# Altium schematic sheet PowerSupply.SchDoc
size B; CompanyName: Microchip Technology Inc.; Organization: Microchip Technology; Address1: 2355 West Chandler Blvd.; Address2: Chandler, AZ  85224; Address4: USA; SheetNumber: 2; SheetTotal: 2; SheetTitle: **; Time: Time
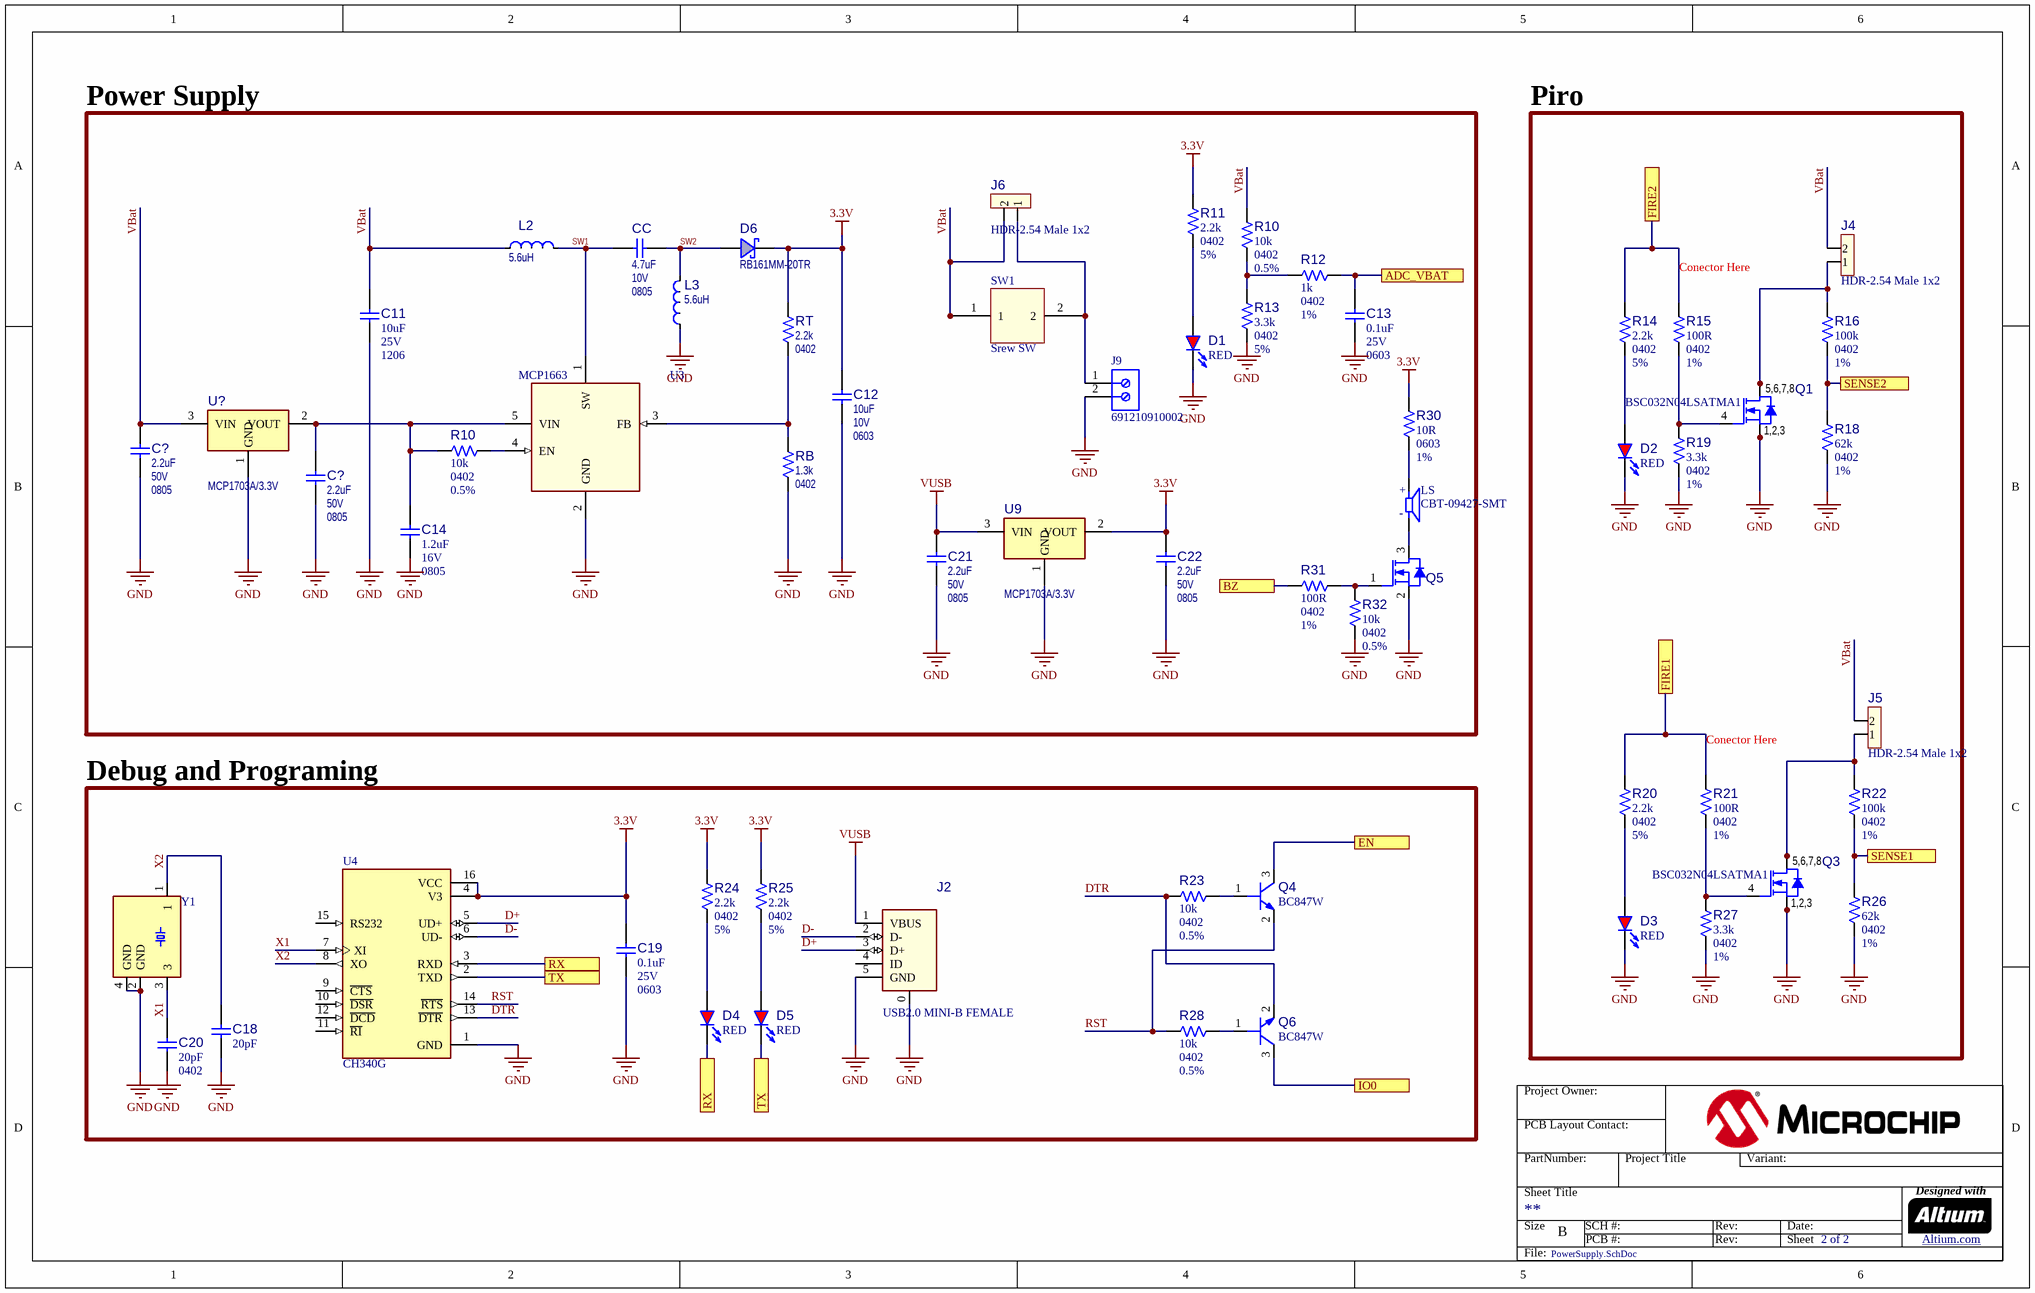
[diagram p0: PowerSupply.SchDoc]

## Parts
(Parts that share a designator on the sheet are numbered #1, #2 ... from top to bottom, then left to right.)
C11  value 10uF  Voltage: 25V  Package: 1206  [CAP_C_1206]  (hidden comment: Capacitor NP)
C12  value 10uF  Voltage: 10V  Package: 0603  [CAP_C_0603]  (hidden comment: Capacitor NP)
C13  value 0.1uF  Voltage: 25V  Package: 0603  [CAP_C_0603]  (hidden comment: Capacitor NP)
C14  value 1.2uF  Voltage: 16V  Package: 0805  [CAP_C_0805]  (hidden comment: Capacitor NP)
C18  value 20pF  [CAP_C_0402]  (hidden comment: Capacitor NP)
C19  value 0.1uF  Voltage: 25V  Package: 0603  [CAP_C_0603]  (hidden comment: Capacitor NP)
C20  value 20pF  Package: 0402  [CAP_C_0402]  (hidden comment: Capacitor NP)
C21  value 2.2uF  Voltage: 50V  Package: 0805  [CAP_C_0805]  (hidden comment: Capacitor NP)
C22  value 2.2uF  Voltage: 50V  Package: 0805  [CAP_C_0805]  (hidden comment: Capacitor NP)
C?#1  value 2.2uF  Voltage: 50V  Package: 0805  [CAP_C_0805]  (hidden comment: Capacitor NP)
C?#2  value 2.2uF  Voltage: 50V  Package: 0805  [CAP_C_0805]  (hidden comment: Capacitor NP)
CC  value 4.7uF  Voltage: 10V  Package: 0805  [CAP_C_0805]  (hidden comment: Capacitor NP)
D1  value RED  [LED_0603_RED]  (hidden comment: LED_red)
D2  value RED  [LED_0603_RED]  (hidden comment: LED_red)
D3  value RED  [LED_0603_RED]  (hidden comment: LED_red)
D4  value RED  [LED_0603_RED]  (hidden comment: LED_red)
D5  value RED  [LED_0603_RED]  (hidden comment: LED_red)
D6  value RB161MM-20TR  [SOD-123FL_L]  (hidden comment: Diode Schottky)
J2  value USB2.0 MINI-B FEMALE  [CON_USB-B_Mini_SMD_RA_HIR_UX60-MB-5ST]  (hidden comment: CON USB2.0 Mini_Micro)
J4  value HDR-2.54 Male 1x2  [HDR_M_2.54_1x2]  (hidden comment: Header 1x2)
J5  value HDR-2.54 Male 1x2  [HDR_M_2.54_1x2]  (hidden comment: Header 1x2)
J6  value HDR-2.54 Male 1x2  [HDR_M_2.54_1x2]  (hidden comment: Header 1x2)
J9  691210910002  [691210910002]
L2  value 5.6uH  [IND_CFT_SRP3020_L3.5W3.2H1.8_L]  (hidden comment: Inductor)
L3  value 5.6uH  [IND_CFT_SRP3020_L3.5W3.2H1.8_L]  (hidden comment: Inductor)
LS  CBT-09427-SMT  [CUI_CBT-09427-SMT]
Q1  value BSC032N04LSATMA1  [PDFN-8_5x6]  (hidden comment: Transistor MOS-N SSSGDDDD)
Q3  value BSC032N04LSATMA1  [PDFN-8_5x6]  (hidden comment: Transistor MOS-N SSSGDDDD)
Q4  value BC847W  [SOT-323-3]  (hidden comment: Transistor NPN BEC)
Q5  Transistor MOS-N GSD  [SOT-23-3]  (value not drawn)
Q6  value BC847W  [SOT-323-3]  (hidden comment: Transistor NPN BEC)
R10#1  value 10k  Package: 0402  Tolerance: 0.5%  [RES_C_0402]  (hidden comment: Resistor)
R10#2  value 10k  Package: 0402  Tolerance: 0.5%  [RES_C_0402]  (hidden comment: Resistor)
R11  value 2.2k  Package: 0402  Tolerance: 5%  [RES_C_0402]  (hidden comment: Resistor)
R12  value 1k  Package: 0402  Tolerance: 1%  [RES_C_0402]  (hidden comment: Resistor)
R13  value 3.3k  Package: 0402  Tolerance: 5%  [RES_C_0402]  (hidden comment: Resistor)
R14  value 2.2k  Package: 0402  Tolerance: 5%  [RES_C_0402]  (hidden comment: Resistor)
R15  value 100R  Package: 0402  Tolerance: 1%  [RES_C_0402]  (hidden comment: Resistor)
R16  value 100k  Package: 0402  Tolerance: 1%  [RES_C_0402]  (hidden comment: Resistor)
R18  value 62k  Package: 0402  Tolerance: 1%  [RES_C_0402]  (hidden comment: Resistor)
R19  value 3.3k  Package: 0402  Tolerance: 1%  [RES_C_0402]  (hidden comment: Resistor)
R20  value 2.2k  Package: 0402  Tolerance: 5%  [RES_C_0402]  (hidden comment: Resistor)
R21  value 100R  Package: 0402  Tolerance: 1%  [RES_C_0402]  (hidden comment: Resistor)
R22  value 100k  Package: 0402  Tolerance: 1%  [RES_C_0402]  (hidden comment: Resistor)
R23  value 10k  Package: 0402  Tolerance: 0.5%  [RES_C_0402]  (hidden comment: Resistor)
R24  value 2.2k  Package: 0402  Tolerance: 5%  [RES_C_0402]  (hidden comment: Resistor)
R25  value 2.2k  Package: 0402  Tolerance: 5%  [RES_C_0402]  (hidden comment: Resistor)
R26  value 62k  Package: 0402  Tolerance: 1%  [RES_C_0402]  (hidden comment: Resistor)
R27  value 3.3k  Package: 0402  Tolerance: 1%  [RES_C_0402]  (hidden comment: Resistor)
R28  value 10k  Package: 0402  Tolerance: 0.5%  [RES_C_0402]  (hidden comment: Resistor)
R30  value 10R  Package: 0603  Tolerance: 1%  [RES_C_0603]  (hidden comment: Resistor)
R31  value 100R  Package: 0402  Tolerance: 1%  [RES_C_0402]  (hidden comment: Resistor)
R32  value 10k  Package: 0402  Tolerance: 0.5%  [RES_C_0402]  (hidden comment: Resistor)
RB  value 1.3k  Package: 0402  [RES_C_0402]  (hidden comment: Resistor)
RT  value 2.2k  Package: 0402  [RES_C_0402]  (hidden comment: Resistor)
SW1  Srew SW  [Screw_SW]
U3  value MCP1663  [SOT-23-5]  (hidden comment: MCP1663 SOT-23-5)
U4  CH340G  [SOIC127P600X180-16N]
U9  value MCP1703A/3.3V  [SOT-23A-3]  (hidden comment: MCP170X SOT-23-3_SOT-23A-3)
U?  value MCP1703A/3.3V  [SOT-23A-3]  (hidden comment: MCP170X SOT-23-3_SOT-23A-3)
Y1  ABM8-12.000MHZ-B2-T3  [OSCSC320X250X100N]  (value not drawn)

## Blocks framed on the sheet
Power Supply: C11-C14 C21 C22 C?#1 C?#2 CC D1 D6 J6 J9 L2 L3 LS Q5 R10#1 R10#2 R11-R13 R30-R32 RB RT SW1 U3 U9 U?
Piro: D2 D3 J4 J5 Q1 Q3 R14-R16 R18-R22 R26 R27
Debug and Programing: C18-C20 D4 D5 J2 Q4 Q6 R23-R25 R28 U4 Y1

## Ports
ADC_VBAT, BZ, EN, FIRE1, FIRE2, IO0, RX, SENSE1, SENSE2, TX

## Nets
3.3V: C12.2 C19.2 C22.2 D6.2(K) R11.2 R24.2 R25.2 R30.2 RT.2 U4.4(V3) U4.16(VCC) U9.2(VOUT)
GND: C11.1 C12.1 C13.1 C14.1 C18.1 C19.1 C20.1 C21.1 C22.1 C?#1.1 C?#2.1 D1.2(K) D2.2(K) D3.2(K) J2.0(SHLD) J2.5(GND) J9.2 L3.1(S) Q1.1(S) Q1.2(S) Q1.3(S) Q3.1(S) Q3.2(S) Q3.3(S) Q5.2(S) R13.1 R18.1 R19.1 R26.1 R27.1 R32.1 RB.1 U3.2(GND) U4.1(GND) U9.1(GND) U?.1(GND) Y1.2(GND) Y1.4(GND)
VUSB: C21.2 J2.1(VBUS) U9.3(VIN)
ADC_VBAT: C13.2 R12.2 ; port ADC_VBAT
BZ: R31.2 ; port BZ
D+: J2.3(D+) U4.5(UD+)
D-: J2.2(D-) U4.6(UD-)
DTR: Q6.2(E) R23.1 U4.13(~{DTR})
EN: Q4.3(C) ; port EN
FIRE1: R20.2 R21.2 ; port FIRE1
FIRE2: R14.2 R15.2 ; port FIRE2
IO0: Q6.3(C) ; port IO0
RST: Q4.2(E) R28.1 U4.14(~{RTS})
RX: D4.2(K) U4.3(RXD) ; port RX
SENSE1: R22.1 R26.2 ; port SENSE1
SENSE2: R16.1 R18.2 ; port SENSE2
SW1: CC.1 L2.2(F) U3.1(SW)
SW2: CC.2 D6.1(A) L3.2(F)
TX: D5.2(K) U4.2(TXD) ; port TX
VBat: C11.2 C?#1.2 J4.2 J5.2 J6.2 L2.1(S) R10#1.2 SW1.1 U?.3(VIN)
X1: C20.2 U4.7(XI) Y1.3
X2: C18.2 U4.8(XO) Y1.1
NetC14_2: C14.2 C?#2.2 R10#2.2 U3.5(VIN) U?.2(VOUT)
NetD1_1: D1.1(A) R11.1
NetD2_1: D2.1(A) R14.1
NetD3_1: D3.1(A) R20.1
NetD4_1: D4.1(A) R24.1
NetD5_1: D5.1(A) R25.1
NetJ4_1: J4.1 Q1.5(D) Q1.6(D) Q1.7(D) Q1.8(D) R16.2
NetJ5_1: J5.1 Q3.5(D) Q3.6(D) Q3.7(D) Q3.8(D) R22.2
NetJ6_1: J6.1 J9.1 SW1.2
NetLS_M: LS.M Q5.3(D)
NetLS_P: LS.P R30.1
NetQ1_4: Q1.4(G) R15.1 R19.2
NetQ3_4: Q3.4(G) R21.1 R27.2
NetQ4_1: Q4.1(B) R23.2
NetQ5_1: Q5.1(G) R31.1 R32.2
NetQ6_1: Q6.1(B) R28.2
NetR10#1_1: R10#1.1 R12.1 R13.2
NetR10#2_1: R10#2.1 U3.4(EN)
NetRB_2: RB.2 RT.1 U3.3(FB)

Not connected (* = marked no-connect by the designer): J2 4(ID); U4 9(~{CTS}) 10(~{DSR}) 11(~{RI}) 12(~{DCD}) 15(RS232)

## Notes on the sheet
- (near R15) Conector Here
- (near R21) Conector Here
- Project Owner:
- PCB Layout Contact:
- PartNumber:
- Project Title
- Variant:
- Sheet Title
- Size
- B
- SCH #:
- PCB #:
- Rev:
- Date:
- Sheet
- Designed with
- Altium.com <http://go.altium.com/MicrochipLandingPage_Evaluation.html>
- File:
- (in symbol CBT-09427-SMT) +; -
- (in symbol TRA1320) 5,6,7,8; 1,2,3

## Library data of the parts
C11 = CAP1159: Manufacturer 1: Murata Electronics North America; Manufacturer Part Number 1: GRM31CR71E106KA12L; Description_: CAP CER 10uF 25V 10% X7R SMD 1206; Dev Tools Status: Production; Tolerance: 10%; Temperature Coefficient: X7R; Type: Ceramic; Owner: Adrian T (M91397); Populated: Yes; MCHP-ID: CAP1159; Revision: 0; Symbol: Capacitor NP; Status: MCL Design; ComponentLink1URL: https://chn-vm-apps.microchip.com/mchprepo/parts/Datasheets/mlcc01_e.pdf; ComponentLink1Description: SVN Datasheet; ComponentLink2URL: C:\ALTIUM_WORK\00001_MCHP-CDB\Datasheets\mlcc01_e.pdf; ComponentLink2Description: Local Datasheet; ComponentLink3URL: C:\ALTIUM_WORK\00001_MCHP-CDB\Library\LibraryRefs\Capacitor NP.SchLib; ComponentLink3Description: Open Symbol; ComponentLink4URL: C:\ALTIUM_WORK\00001_MCHP-CDB\Library\Footprints\CAP_C_1206.PcbLib; ComponentLink4Description: Open Footprint; ComponentLink5Description: Open Footprint 2; ComponentLink6Description: Open Footprint 3; ComponentLink7Description: Open Footprint 4; Operating Temperature: -55C to +125C; Category: Capacitor; Manufacturer 2: Taiyo Yuden; Manufacturer Part Number 2: TMK316B7106KL-TD; Supplier 1: Digi-Key; Supplier Part Number 1: 490-6518-1-ND; Supplier 2: Digi-Key; Supplier Part Number 2: 587-2399-1-ND; Quantity Override: 1
C12 = CAP0542: Capacitor; Manufacturer 1: Samsung; Manufacturer Part Number 1: CL10A106MP8NNNC; Description_: CAP CER 10uF 10V 20% X5R SMD 0603; Dev Tools Status: Production; Tolerance: 20%; Temperature Coeffcient: X5R; Type: Ceramic; Populated: Yes; MCHP-ID: CAP0542; Revision: 2; Symbol: Capacitor NP; Status: MCL Design; ComponentLink1URL: https://chn-vm-apps.microchip.com/mchprepo/parts/Datasheets/ECJ__General_.pdf; ComponentLink1Description: SVN Datasheet; ComponentLink2URL: C:\ALTIUM_WORK\00001_MCHP-CDB\Datasheets\ECJ__General_.pdf; ComponentLink2Description: Local Datasheet; ComponentLink3URL: C:\ALTIUM_WORK\00001_MCHP-CDB\Library\LibraryRefs\Capacitor NP.SchLib; ComponentLink3Description: Open Symbol; ComponentLink4URL: C:\ALTIUM_WORK\00001_MCHP-CDB\Library\Footprints\CAP_C_0603.PcbLib; ComponentLink4Description: Open Footprint; ComponentLink5Description: Open Footprint 2; ComponentLink6Description: Open Footprint 3; ComponentLink7Description: Open Footprint 4; Operating Temperature: -55C to +85C; Category: Capacitor; Manufacturer 2: TDK Corporation; Manufacturer Part Number 2: C1608X5R1A106M; Manufacturer 3: Panasonic; Manufacturer Part Number 3: ECJ-1VB1A106M; Supplier 1: Digi-Key; Supplier Part Number 1: 1276-1871-1-ND; Supplier 2: Digi-Key; Supplier Part Number 2: 445-6853-1-ND; Supplier 3: Digi-Key; Supplier Part Number 3: PCC2479CT-ND; Quantity Override: 1
C13 C19 = CAP0380: Manufacturer 1: AVX; Manufacturer Part Number 1: 06033D104KAT2A; Description_: CAP CER 0.1uF 25V 10% X5R SMD 0603; Dev Tools Status: Production; Tolerance: 10%; Temperature Coefficient: X5R; Type: Ceramic; Populated: Yes; MCHP-ID: CAP0380; Revision: 1; Symbol: Capacitor NP; Status: MCL Design; ComponentLink1URL: https://chn-vm-apps.microchip.com/mchprepo/parts/Datasheets/smccp.pdf; ComponentLink1Description: SVN Datasheet; ComponentLink2URL: C:\ALTIUM_WORK\00001_MCHP-CDB\Datasheets\smccp.pdf; ComponentLink2Description: Local Datasheet; ComponentLink3URL: C:\ALTIUM_WORK\00001_MCHP-CDB\Library\LibraryRefs\Capacitor NP.SchLib; ComponentLink3Description: Open Symbol; ComponentLink4URL: C:\ALTIUM_WORK\00001_MCHP-CDB\Library\Footprints\CAP_C_0603.PcbLib; ComponentLink4Description: Open Footprint; ComponentLink5Description: Open Footprint 2; ComponentLink6Description: Open Footprint 3; ComponentLink7Description: Open Footprint 4; Operating Temperature: -55C to +85C; Category: Capacitor; Supplier 1: Digi-Key; Supplier Part Number 1: 478-1244-1-ND; Quantity Override: 1
C14 = CAP1752: Manufacturer 1: KEMET; Manufacturer Part Number 1: C0805C125K4RACTU; Description_: CAP CER 1.2uF 16V 10% X7R SMD 0805; Dev Tools Status: Design; Tolerance: 10%; Temperature Coefficient: X7R; Type: Ceramic; Owner: Alexandru Chiser - M19201; Populated: YES; MCHP-ID: CAP1752; Revision: A; Symbol: Capacitor NP; Status: MCL Design; ComponentLink1URL: https://chn-vm-apps.microchip.com/mchprepo/parts/Datasheets/KEM_C1002_X7R_SMD.pdf; ComponentLink1Description: SVN Datasheet; ComponentLink2URL: C:\ALTIUM_WORK\00001_MCHP-CDB\Datasheets\KEM_C1002_X7R_SMD.pdf; ComponentLink2Description: Local Datasheet; ComponentLink3URL: C:\ALTIUM_WORK\00001_MCHP-CDB\Library\LibraryRefs\Capacitor NP.SchLib; ComponentLink3Description: Open Symbol; ComponentLink4URL: C:\ALTIUM_WORK\00001_MCHP-CDB\Library\Footprints\CAP_C_0805.PcbLib; ComponentLink4Description: Open Footprint; ComponentLink5Description: Open Footprint 2; ComponentLink6Description: Open Footprint 3; ComponentLink7Description: Open Footprint 4; Operating Temperature: -55C to +125C; Category: Capacitor; Supplier 1: Digi-Key; Supplier Part Number 1: 399-4927-1-ND; Quantity Override: 1
C18 C20 = CAP2438: Manufacturer 1: Samsung Electro-Mechanics; Manufacturer Part Number 1: CL05C200GB51PNC; Voltage: 50V; Description_: Ceramic capacitor, SMD 0402, 20pF, C0G, 50V, +/-2%; Dev Tools Status: Production; Tolerance: 2%; Temperature Coefficient: C0G; Type: Ceramic; Owner: Dragos Danaila; Populated: YES; MCHP-ID: CAP2438; Revision: 1; Symbol: Capacitor NP; Status: MCL Design; ComponentLink1Description: SVN Datasheet; ComponentLink2Description: Local Datasheet; ComponentLink3URL: C:\ALTIUM_WORK\00001_MCHP-CDB\Library\LibraryRefs\Capacitor NP.SchLib; ComponentLink3Description: Open Symbol; ComponentLink4URL: C:\ALTIUM_WORK\00001_MCHP-CDB\Library\Footprints\CAP_C_0402.PcbLib; ComponentLink4Description: Open Footprint; ComponentLink5Description: Open Footprint 2; ComponentLink6Description: Open Footprint 3; ComponentLink7Description: Open Footprint 4; Operating Temperature: -55C to +125C; Category: Capacitor; Supplier 1: Digikey; Supplier Part Number 1: 1276-CL05C200GB51PNCTR-ND; Quantity Override: 1
  C18: Package: 0402
C21 C22 C?#1 C?#2 = CAP1017: Capacitor; Manufacturer 1: TDK; Manufacturer Part Number 1: C2012X5R1H225K; Description_: CAP CER 2.2uF 50V 10% X5R SMD 0805; Dev Tools Status: Production; Tolerance: 10%; Temperature Coeffcient: X5R; Type: Ceramic; Owner: Brent Lanphear; Populated: Yes; MCHP-ID: CAP1017; Revision: 2; Symbol: Capacitor NP; Status: MCL Design; ComponentLink1URL: https://chn-vm-apps.microchip.com/mchprepo/parts/Datasheets/general_B11.pdf; ComponentLink1Description: SVN Datasheet; ComponentLink2URL: C:\ALTIUM_WORK\00001_MCHP-CDB\Datasheets\general_B11.pdf; ComponentLink2Description: Local Datasheet; ComponentLink3URL: C:\ALTIUM_WORK\00001_MCHP-CDB\Library\LibraryRefs\Capacitor NP.SchLib; ComponentLink3Description: Open Symbol; ComponentLink4URL: C:\ALTIUM_WORK\00001_MCHP-CDB\Library\Footprints\CAP_C_0805.PcbLib; ComponentLink4Description: Open Footprint; ComponentLink5Description: Open Footprint 2; ComponentLink6Description: Open Footprint 3; ComponentLink7Description: Open Footprint 4; Operating Temperature: -55C to +85C; Category: Capacitor; Supplier 1: Digi-Key; Supplier Part Number 1: 445-5976-1-ND; Quantity Override: 1
CC = CAP0092: Capacitor; Manufacturer 1: Panasonic; Manufacturer Part Number 1: ECJ-2YF1A475Z; Description_: CAP CER 4.7uF 10V 20% Y5V SMD 0805; Dev Tools Status: Production; Tolerance: 20%; Temperature Coeffcient: Y5V; Populated: Yes; MCHP-ID: CAP0092; Revision: 1; Symbol: Capacitor NP; Status: MCL Design; ComponentLink1URL: https://chn-vm-apps.microchip.com/mchprepo/parts/Datasheets/ECJ__General_.pdf; ComponentLink1Description: SVN Datasheet; ComponentLink2URL: C:\ALTIUM_WORK\00001_MCHP-CDB\Datasheets\ECJ__General_.pdf; ComponentLink2Description: Local Datasheet; ComponentLink3URL: C:\ALTIUM_WORK\00001_MCHP-CDB\Library\LibraryRefs\Capacitor NP.SchLib; ComponentLink3Description: Open Symbol; ComponentLink4URL: C:\ALTIUM_WORK\00001_MCHP-CDB\Library\Footprints\CAP_C_0805.PcbLib; ComponentLink4Description: Open Footprint; ComponentLink5Description: Open Footprint 2; ComponentLink6Description: Open Footprint 3; ComponentLink7Description: Open Footprint 4; Operating Temperature: -30C to +85C; Type: Ceramic; Category: Capacitor; Supplier 1: Digi-Key; Supplier Part Number 1: PCC1842TR-ND; Quantity Override: 1
D1-D5 = DIODE1066: LED; Manufacturer 1: Lumex; Manufacturer Part Number 1: SML-LX0603SRW-TR; Description_: DIO LED RED 1.7V 20mA 15mcd Diffuse SMD 0603; Dev Tools Status: Production; Type: LED Single; Forward Current: 20mA; Reverse Current: 100uA; Reverse Voltage: 5V; Owner: Tad Ahlvers; Populated: YES; MCHP-ID: DIODE1066; Revision: 1; Symbol: LED_red; Status: MCL Design; Package: 0603; ComponentLink1URL: https://chn-vm-apps.microchip.com/mchprepo/parts/Datasheets/SML-LX0603SRW-TR.pdf; ComponentLink1Description: SVN Datasheet; ComponentLink2URL: C:\ALTIUM_WORK\00001_MCHP-CDB\Datasheets\SML-LX0603SRW-TR.pdf; ComponentLink2Description: Local Datasheet; ComponentLink3URL: C:\ALTIUM_WORK\00001_MCHP-CDB\Library\LibraryRefs\LED_red.SchLib; ComponentLink3Description: Open Symbol; ComponentLink4URL: C:\ALTIUM_WORK\00001_MCHP-CDB\Library\Footprints\LED_0603_RED.PcbLib; ComponentLink4Description: Open Footprint; ComponentLink5Description: Open Footprint 2; ComponentLink6Description: Open Footprint 3; ComponentLink7Description: Open Footprint 4; Operating Temperature: -40C to +85C; Category: Diode; Supplier 1: Digi-Key; Supplier Part Number 1: 67-1551-1-ND; Quantity Override: 1
D6 = DIODE1297: DIO SCTKY RB160M-60TR 550mV 1A 60V SMD SOD-123F; Manufacturer 1: Rohm Semiconductor; Description_: DIO SCTKY RB161MM-20TR 350mV 1A 20V SMD SOD-123F; Dev Tools Status: Production; Type: Schottky Single; Reverse Current: 700uA; Reverse Recovery Time: 500ns; Reverse Voltage: 20V; Owner: Tim Moffat; Populated: YES; MCHP-ID: DIODE1297; Revision: 1; Symbol: Diode Schottky; Status: MCL Design; Package: SOD-123F; ComponentLink1URL: https://chn-vm-apps.microchip.com/mchprepo/parts/Datasheets/rb161mm-20.pdf; ComponentLink1Description: SVN Datasheet; ComponentLink2URL: C:\ALTIUM_WORK\00001_MCHP-CDB\Datasheets\rb161mm-20.pdf; ComponentLink2Description: Local Datasheet; ComponentLink3URL: C:\ALTIUM_WORK\00001_MCHP-CDB\Library\LibraryRefs\Diode Schottky.SchLib; ComponentLink3Description: Open Symbol; ComponentLink4URL: C:\ALTIUM_WORK\00001_MCHP-CDB\Library\Footprints\SOD-123FL.PcbLib; ComponentLink4Description: Open Footprint; ComponentLink5URL: C:\ALTIUM_WORK\00001_MCHP-CDB\Library\Footprints\SOD-123FL_L.PcbLib; ComponentLink5Description: Open Footprint 2; ComponentLink6Description: Open Footprint 3; ComponentLink7Description: Open Footprint 4; Operating Temperature: -40C to +125C; Category: Diode; Forward Current: 1A; Manufacturer Part Number 1: RB161MM-20TR; Supplier 1: Digi-Key; Supplier Part Number 1: RB161MM-20CT-ND; Quantity Override: 1
J2 = CON0276: Manufacturer 1: Wurth Electronics Inc; Manufacturer Part Number 1: 651305142821; Description_: CON USB2.0 MINI-B FEMALE SMD R/A; Dev Tools Status: Production; Populated: YES; MCHP-ID: CON0276; Revision: 2; Symbol: CON USB2.0 Mini_Micro; Status: MCL Design; ComponentLink1URL: https://chn-vm-apps.microchip.com/mchprepo/parts/Datasheets/e24000019.pdf; ComponentLink1Description: SVN Datasheet; ComponentLink2URL: C:\ALTIUM_WORK\00001_MCHP-CDB\Datasheets\e24000019.pdf; ComponentLink2Description: Local Datasheet; ComponentLink3URL: C:\ALTIUM_WORK\00001_MCHP-CDB\Library\LibraryRefs\CON USB2.0 Mini_Micro.SchLib; ComponentLink3Description: Open Symbol; ComponentLink4URL: C:\ALTIUM_WORK\00001_MCHP-CDB\Library\Footprints\CON_USB-B_Mini_SMD_RA_HIR_UX60-MB-5ST.PcbLib; ComponentLink4Description: Open Footprint; ComponentLink5Description: Open Footprint 2; ComponentLink6Description: Open Footprint 3; ComponentLink7Description: Open Footprint 4; Type: USB; Category: Connector; Manufacturer 2: Hirose; Manufacturer Part Number 2: UX60-MB-5ST; Manufacturer 3: Oupiin; Manufacturer Part Number 3: 8969-B05C00DBU; Manufacturer 4: Dongguan Yang Ming Precision Plastic Hardware Electronics Co., Ltd. (ShenZhen YangMing); Manufacturer Part Number 4: YM-02-04-A-36; Supplier 1: Digi-Key; Supplier Part Number 1: 732-3154-1-ND; Supplier 2: Digi-Key; Supplier Part Number 2: H2959CT-ND; Supplier 3: Digi-Key; Supplier Part Number 3: H2959TR-ND; Supplier 4: Oupiin; Supplier Part Number 4: 8969-B05C00DBU; Supplier 5: Raynen; Supplier Part Number 5: PLUG00033B01M; Quantity Override: 1
J4-J6 = CON1108: Manufacturer 1: FCI; Manufacturer Part Number 1: 68001-202HLF; Manufacturer 10: WURTH ELEKTRONIK; Manufacturer Part Number 10: 61300211121; Description_: CON HDR-2.54 Male 1x2 Gold 5.84MH TH VERT; Dev Tools Status: Production; Owner: Bogdan P (M91398); Populated: Yes; MCHP-ID: CON1108; Revision: 1; Symbol: Header 1x2; Status: MCL Design; ComponentLink1URL: https://chn-vm-apps.microchip.com/mchprepo/parts/Datasheets/77311.pdf; ComponentLink1Description: SVN Datasheet; ComponentLink2URL: C:\ALTIUM_WORK\00001_MCHP-CDB\Datasheets\77311.pdf; ComponentLink2Description: Local Datasheet; ComponentLink3URL: C:\ALTIUM_WORK\00001_MCHP-CDB\Library\LibraryRefs\Header 1x2.SchLib; ComponentLink3Description: Open Symbol; ComponentLink4URL: C:\ALTIUM_WORK\00001_MCHP-CDB\Library\Footprints\HDR_M_2.54_1x2.PcbLib; ComponentLink4Description: Open Footprint; ComponentLink5Description: Open Footprint 2; ComponentLink6Description: Open Footprint 3; ComponentLink7Description: Open Footprint 4; Type: Header 2.54mm; Category: Connector; Manufacturer 2: FCI; Manufacturer Part Number 2: 77311-118-02LF; Manufacturer 3: FCI; Manufacturer Part Number 3: 68000-202HLF; Manufacturer 4: Samtec; Manufacturer Part Number 4: TSW-102-07-G-S; Manufacturer 5: Sullins; Manufacturer Part Number 5: PBC02SAAN; Manufacturer 6: SPC Technology; Manufacturer Part Number 6: SPC20481; Manufacturer 7: Samtec; Manufacturer Part Number 7: TSW-102-07-F-S; Manufacturer 8: Nextron; Manufacturer Part Number 8: R-211-0211-0021-000; Manufacturer 9: Samtec; Manufacturer Part Number 9: TSW-102-07-S-S; Supplier 1: Digi-Key; Supplier Part Number 1: 609-3469-ND; Supplier 2: Digi-Key; Supplier Part Number 2: 609-4434-ND; Supplier 3: Digi-Key; Supplier Part Number 3: 609-3502-ND; Supplier 4: Digi-Key; Supplier Part Number 4: SAM1029-02-ND; Supplier 5: Digi-Key; Supplier Part Number 5: S1011E-02-ND; Supplier 6: Newark; Supplier Part Number 6: 93K5734; Supplier 7: Newark; Supplier Part Number 7: 79P3146; Supplier 8: Nextron; Supplier Part Number 8: Nextron R-211-0211-0021-000; Supplier 9: Samtec; Supplier Part Number 9: TSW-102-07-S-S; Supplier 10: Digi-Key; Supplier Part Number 10: 732-5315-ND; Quantity Override: 1
J9 = 691210910002: WR-TBL Serie 2109 Horizontal Entry, Rising Cage Clamp, THT, pitch 2.54mm, 2p; Manufacturer: Wurth Elektronik; Modularity: No; PCB/Cable/Panel: PCB; Pin Number: 2; Rated Current [UL]: 6A; Working Voltage [UL]: 150VAC; ComponentLink1Description: Manufacturer; ComponentLink1URL: http://www.we-online.de; ComponentLink2URL: https://katalog.we-online.de/em/datasheet/691210910002.pdf; ComponentLink2Description: Datasheet; Mounting Technology: THT; Manufacturer Part Number: 691210910002; Packaging: Box; Operating Temperature: -40 to +105degC; Pitch: 2.54mm; Published Date: Feburary 2021; Type: Horizontal; Application: Rising Cage Clamp
L2 L3 = IND1638: Manufacturer 1: Bourns Inc.; Manufacturer Part Number 1: SRP3020TA-5R6M; Description_: FIXED IND 5.6uH 2.2A 238mOHM SMD AEC-Q200; Dev Tools Status: Design; Owner: Cristian Papuc; DCR: 0.238R; Saturation Current: 2.6A; RMS Current: 2.2A; Test Frequency: 100kHz; Populated: YES; MCHP-ID: IND1638; Revision: A; Symbol: Inductor; Status: MCL Design; ComponentLink1URL: https://chn-vm-apps.microchip.com/mchprepo/parts/Datasheets/srp3020ta.pdf; ComponentLink1Description: SVN Datasheet; ComponentLink2URL: C:\ALTIUM_WORK\00001_MCHP-CDB\Datasheets\srp3020ta.pdf; ComponentLink2Description: Local Datasheet; ComponentLink3URL: C:\ALTIUM_WORK\00001_MCHP-CDB\Library\LibraryRefs\Inductor.SchLib; ComponentLink3Description: Open Symbol; ComponentLink4URL: C:\ALTIUM_WORK\00001_MCHP-CDB\Library\Footprints\IND_CFT_SRP3020_L3.5W3.2H1.8.PcbLib; ComponentLink4Description: Open Footprint; ComponentLink5URL: C:\ALTIUM_WORK\00001_MCHP-CDB\Library\Footprints\IND_CFT_SRP3020_L3.5W3.2H1.8_L.PcbLib; ComponentLink5Description: Open Footprint 2; ComponentLink6Description: Open Footprint 3; ComponentLink7Description: Open Footprint 4; Operating Temperature: -40C ~ 150C; Package: L3.5xW3.2xH1.8; Type: Inductor; Category: Inductor; Supplier 1: Digi-Key; Supplier Part Number 1: SRP3020TA-5R6MCT-ND; Quantity Override: 1
LS = CBT-09427-SMT: 9 mm, 3.6 V, 87 dB, Surface Mount _SMT_, Magnetic Audio Transducer Buzzer; MF: CUI Devices; MP: CBT-09427-SMT-TR; SnapEDA_Link: https://www.snapeda.com/parts/CBT-09427-SMT-TR/CUI%20Devices/view-part/547873/?ref=snap; Availability: Unavailable; Value: *; Price: None; Package: CUI Inc.; CUI_purchase_URL: https://www.cuidevices.com/product/audio/buzzers/audio-transducers/cbt-09427-smt-tr?utm_source=snapeda.com&utm_medium=referral&utm_campaign=snapedaBOM
Q1 Q3 = TRA1320: Manufacturer 1: Infineon Technologies; Description_: TRANS FET N-CH  BSC032N04LSATMA1 40V 98A 52W TDSON-8; Dev Tools Status: Design; Type: FET; Current: 98A; Drain to Source Voltage: 40V; Gate to Source Voltage: 2V; Power: 52W; Owner: Cristian Papuc; Populated: YES; MCHP-ID: TRA1320; Revision: 1; Symbol: Transistor MOS-N SSSGDDDD; Status: MCL Design; Package: TDSON-8; ComponentLink1URL: https://chn-vm-apps.microchip.com/mchprepo/parts/Datasheets/Infineon-BSC032N04LS-DS-v02_01-EN.pdf; ComponentLink1Description: SVN Datasheet; ComponentLink2URL: C:\ALTIUM_WORK\00001_MCHP-CDB\Datasheets\Infineon-BSC032N04LS-DS-v02_01-EN.pdf; ComponentLink2Description: Local Datasheet; ComponentLink3URL: C:\ALTIUM_WORK\00001_MCHP-CDB\Library\LibraryRefs\Transistor MOS-N SSSGDDDD.SchLib; ComponentLink3Description: Open Symbol; ComponentLink4URL: C:\ALTIUM_WORK\00001_MCHP-CDB\Library\Footprints\PDFN-8_5x6.PcbLib; ComponentLink4Description: Open Footprint; ComponentLink5Description: Open Footprint 2; ComponentLink6Description: Open Footprint 3; ComponentLink7Description: Open Footprint 4; Operating Temperature: -55C to +150C; Category: Transistor; Voltage: 40V; Manufacturer Part Number 1: BSC032N04LSATMA1; Supplier 1: Digikey; Supplier Part Number 1: BSC032N04LSATMA1CT-ND; Quantity Override: 1
Q4 Q6 = TRA0094: Transistor Bipolar; Manufacturer 1: NXP Semiconductors; Manufacturer Part Number 1: BC847BW,135; Description_: TRANS BJT NPN BC847W 45V 100mA 200mW SOT-323-3; Dev Tools Status: Production; Type: BJT; Current: 100mA; Power: 200mW; Voltage: 45V; Populated: YES; MCHP-ID: TRA0094; Revision: 2; Symbol: Transistor NPN BEC; Status: MCL Design; Package: SOT-323-3; ComponentLink1URL: https://chn-vm-apps.microchip.com/mchprepo/parts/Datasheets/BC847_BC547_SER.pdf; ComponentLink1Description: SVN Datasheet; ComponentLink2URL: C:\ALTIUM_WORK\00001_MCHP-CDB\Datasheets\BC847_BC547_SER.pdf; ComponentLink2Description: Local Datasheet; ComponentLink3URL: C:\ALTIUM_WORK\00001_MCHP-CDB\Library\LibraryRefs\Transistor NPN BEC.SchLib; ComponentLink3Description: Open Symbol; ComponentLink4URL: C:\ALTIUM_WORK\00001_MCHP-CDB\Library\Footprints\SOT-323-3.PcbLib; ComponentLink4Description: Open Footprint; ComponentLink5Description: Open Footprint 2; ComponentLink6Description: Open Footprint 3; ComponentLink7Description: Open Footprint 4; Operating Temperature: -65C to +150C; Category: Transistor; Supplier 1: Digi-Key; Supplier Part Number 1: BC847BW,135-ND; Quantity Override: 1
Q5 = MIC7247: Transistor MOS; Manufacturer 1: Microchip Technology; Value: 2N7002-G; Description_: MCHP ANALOG MOSFET N-CH 2N7002-G 60V 115mA SOT-23-3; Dev Tools Status: Production; Type: MOSFET; Owner: Mark Loper; Populated: YES; MCHP-ID: MIC7247; Revision: 1; Symbol: Transistor MOS-N GSD; Status: MCL Design; ComponentLink1Description: SVN Datasheet; ComponentLink2URL: C:\ALTIUM_WORK\00001_MCHP-CDB\Datasheets\2N7002.pdf; ComponentLink2Description: Local Datasheet; ComponentLink3URL: C:\ALTIUM_WORK\00001_MCHP-CDB\Library\LibraryRefs\Transistor MOS-N GSD.SchLib; ComponentLink3Description: Open Symbol; ComponentLink4URL: C:\ALTIUM_WORK\00001_MCHP-CDB\Library\Footprints\SOT-23-3.PcbLib; ComponentLink4Description: Open Footprint; ComponentLink5Description: Open Footprint 2; ComponentLink6Description: Open Footprint 3; ComponentLink7Description: Open Footprint 4; Category: MCHP-Analog; Manufacturer Part Number 1: 2N7002-G; Supplier 1: Digi-Key; Supplier Part Number 1: 2N7002-GMCCT-ND; Quantity Override: 1
R10#1 R10#2 R23 R28 R32 = RES1012: Manufacturer 1: SUSUMU; Manufacturer Part Number 1: RR0510P-103-D; Description_: RES TF 10k 0.5% 1/16W SMD 0402; Dev Tools Status: Production; Voltage: 25V; Temperature Coefficient: 25ppm/C; Power: 1/16W; Owner: Tad Ahlvers; Populated: YES; MCHP-ID: RES1012; Revision: 1; Symbol: Resistor; Status: MCL Design; ComponentLink1URL: https://chn-vm-apps.microchip.com/mchprepo/parts/Datasheets/products_12.pdf; ComponentLink1Description: SVN Datasheet; ComponentLink2URL: C:\ALTIUM_WORK\00001_MCHP-CDB\Datasheets\products_12.pdf; ComponentLink2Description: Local Datasheet; ComponentLink3URL: C:\ALTIUM_WORK\00001_MCHP-CDB\Library\LibraryRefs\Resistor.SchLib; ComponentLink3Description: Open Symbol; ComponentLink4URL: C:\ALTIUM_WORK\00001_MCHP-CDB\Library\Footprints\RES_C_0402.PcbLib; ComponentLink4Description: Open Footprint; ComponentLink5Description: Open Footprint 2; ComponentLink6Description: Open Footprint 3; ComponentLink7Description: Open Footprint 4; Operating Temperature: -55C to +125C; Category: Resistor; Type: RES SMD; Composition: TF; Supplier 1: Digi-Key; Supplier Part Number 1: RR05P10.0KDCT-ND; Quantity Override: 1
R11 R14 R20 R24 R25 = RES1020: Manufacturer 1: Vishay Dale; Manufacturer Part Number 1: CRCW04022K20JNED; Description_: RES TKF 2.2k 5% 1/16W SMD 0402; Dev Tools Status: Production; Voltage: 50V; Temperature Coefficient: 200ppm/C; Power: 1/16W; Owner: Tad Ahlvers; Populated: YES; MCHP-ID: RES1020; Revision: 1; Symbol: Resistor; Status: MCL Design; ComponentLink1URL: https://chn-vm-apps.microchip.com/mchprepo/parts/Datasheets/dcrcwe3.pdf; ComponentLink1Description: SVN Datasheet; ComponentLink2URL: C:\ALTIUM_WORK\00001_MCHP-CDB\Datasheets\dcrcwe3.pdf; ComponentLink2Description: Local Datasheet; ComponentLink3URL: C:\ALTIUM_WORK\00001_MCHP-CDB\Library\LibraryRefs\Resistor.SchLib; ComponentLink3Description: Open Symbol; ComponentLink4URL: C:\ALTIUM_WORK\00001_MCHP-CDB\Library\Footprints\RES_C_0402.PcbLib; ComponentLink4Description: Open Footprint; ComponentLink5Description: Open Footprint 2; ComponentLink6Description: Open Footprint 3; ComponentLink7Description: Open Footprint 4; Operating Temperature: -55C to +155C; Category: Resistor; Type: RES SMD; Composition: TKF; Supplier 1: Digi-Key; Supplier Part Number 1: 541-2.2KJCT-ND; Quantity Override: 1
R12 = RES1022: Manufacturer 1: Panasonic; Manufacturer Part Number 1: ERJ-2RKF1001X; Description_: RES TKF 1k 1% 1/10W SMD 0402; Dev Tools Status: Production; Voltage: 50V; Temperature Coefficient: 100ppm/C; Power: 1/10W; Owner: Tad Ahlvers; Populated: YES; MCHP-ID: RES1022; Revision: 2; Symbol: Resistor; Status: MCL Design; ComponentLink1URL: https://chn-vm-apps.microchip.com/mchprepo/parts/Datasheets/AOA0000CE2.pdf; ComponentLink1Description: SVN Datasheet; ComponentLink2URL: C:\ALTIUM_WORK\00001_MCHP-CDB\Datasheets\AOA0000CE2.pdf; ComponentLink2Description: Local Datasheet; ComponentLink3URL: C:\ALTIUM_WORK\00001_MCHP-CDB\Library\LibraryRefs\Resistor.SchLib; ComponentLink3Description: Open Symbol; ComponentLink4URL: C:\ALTIUM_WORK\00001_MCHP-CDB\Library\Footprints\RES_C_0402.PcbLib; ComponentLink4Description: Open Footprint; ComponentLink5Description: Open Footprint 2; ComponentLink6Description: Open Footprint 3; ComponentLink7Description: Open Footprint 4; Operating Temperature: -55C to +155C; Category: Resistor; Type: RES SMD; Composition: TKF; Manufacturer 2: Hottech; Manufacturer Part Number 2: RI0402L1001FT; Supplier 1: Digi-Key; Supplier Part Number 1: P1.00KLTR-ND; Supplier 2: Hottech; Supplier Part Number 2: RI0402L1001FT; Quantity Override: 1
R13 = RES1007: Manufacturer 1: Panasonic - ECG; Manufacturer Part Number 1: ERJ-2GEJ332X; Description_: RES TKF 3.3k 5% 1/10W SMD 0402; Dev Tools Status: Production; Voltage: 50V; Temperature Coefficient: 200ppm/C; Power: 1/10W; Owner: Tad Ahlvers; Populated: YES; MCHP-ID: RES1007; Revision: 0; Symbol: Resistor; Status: MCL Design; ComponentLink1URL: https://chn-vm-apps.microchip.com/mchprepo/parts/Datasheets/AOA0000CE1.pdf; ComponentLink1Description: SVN Datasheet; ComponentLink2URL: C:\ALTIUM_WORK\00001_MCHP-CDB\Datasheets\AOA0000CE1.pdf; ComponentLink2Description: Local Datasheet; ComponentLink3URL: C:\ALTIUM_WORK\00001_MCHP-CDB\Library\LibraryRefs\Resistor.SchLib; ComponentLink3Description: Open Symbol; ComponentLink4URL: C:\ALTIUM_WORK\00001_MCHP-CDB\Library\Footprints\RES_C_0402.PcbLib; ComponentLink4Description: Open Footprint; ComponentLink5Description: Open Footprint 2; ComponentLink6Description: Open Footprint 3; ComponentLink7Description: Open Footprint 4; Operating Temperature: -55C to +155C; Category: Resistor; Type: RES SMD; Composition: TKF; Supplier 1: Digi-Key; Supplier Part Number 1: P3.3KJCT-ND; Quantity Override: 1
R15 R21 R31 = RES1436: Manufacturer 1: Panasonic Electronic Components; Manufacturer Part Number 1: ERJ-2RKF1000X; Description_: RES TKF 100R 1% 1/10W SMD 0402; Dev Tools Status: Production; Temperature Coefficient: ±100ppm/°C; Power: 1/10W; Populated: YES; MCHP-ID: RES1436; Revision: 1; Symbol: Resistor; Status: MCL Design; ComponentLink1URL: https://chn-vm-apps.microchip.com/mchprepo/parts/Datasheets/AOA0000CE2 (1).pdf; ComponentLink1Description: SVN Datasheet; ComponentLink2URL: C:\ALTIUM_WORK\00001_MCHP-CDB\Datasheets\AOA0000CE2 (1).pdf; ComponentLink2Description: Local Datasheet; ComponentLink3URL: C:\ALTIUM_WORK\00001_MCHP-CDB\Library\LibraryRefs\Resistor.SchLib; ComponentLink3Description: Open Symbol; ComponentLink4URL: C:\ALTIUM_WORK\00001_MCHP-CDB\Library\Footprints\RES_C_0402.PcbLib; ComponentLink4Description: Open Footprint; ComponentLink5Description: Open Footprint 2; ComponentLink6Description: Open Footprint 3; ComponentLink7Description: Open Footprint 4; Operating Temperature: -55°C ~ 155°C; Category: Resistor; Type: RES SMD; Composition: TKF; Supplier 1: Digi-Key; Supplier Part Number 1: P100LCT-ND; Quantity Override: 1
R16 R22 = RES1011: Manufacturer 1: Panasonic; Manufacturer Part Number 1: ERJ-2RKF1003X; Description_: RES TKF 100k 1% 1/10W SMD 0402; Dev Tools Status: Production; Voltage: 50V; Temperature Coefficient: 100ppm/C; Power: 1/10W; Owner: Tad Ahlvers; Populated: YES; MCHP-ID: RES1011; Revision: 1; Symbol: Resistor; Status: MCL Design; ComponentLink1URL: https://chn-vm-apps.microchip.com/mchprepo/parts/Datasheets/AOA0000CE2.pdf; ComponentLink1Description: SVN Datasheet; ComponentLink2URL: C:\ALTIUM_WORK\00001_MCHP-CDB\Datasheets\AOA0000CE2.pdf; ComponentLink2Description: Local Datasheet; ComponentLink3URL: C:\ALTIUM_WORK\00001_MCHP-CDB\Library\LibraryRefs\Resistor.SchLib; ComponentLink3Description: Open Symbol; ComponentLink4URL: C:\ALTIUM_WORK\00001_MCHP-CDB\Library\Footprints\RES_C_0402.PcbLib; ComponentLink4Description: Open Footprint; ComponentLink5Description: Open Footprint 2; ComponentLink6Description: Open Footprint 3; ComponentLink7Description: Open Footprint 4; Operating Temperature: -55C to +125C; Category: Resistor; Type: RES SMD; Composition: TKF; Supplier 1: Digi-Key; Supplier Part Number 1: P100KLCT-ND; Quantity Override: 1
R18 R26 = RES2100: Manufacturer 1: Vishay; Manufacturer Part Number 1: CRCW040262K0FKED; Description_: RES TF 62k 1% 1/16W SMD 0402 AEC-Q200; Dev Tools Status: Production; Temperature Coefficient: 100ppm/C; Power: 1/16W; Owner: Cristian Papuc; Populated: YES; MCHP-ID: RES2100; Revision: 1; Symbol: Resistor; Status: MCL Design; ComponentLink1URL: https://chn-vm-apps.microchip.com/mchprepo/parts/Datasheets/SEI-RMCF_RMCP.pdf; ComponentLink1Description: SVN Datasheet; ComponentLink2URL: C:\ALTIUM_WORK\00001_MCHP-CDB\Datasheets\SEI-RMCF_RMCP.pdf; ComponentLink2Description: Local Datasheet; ComponentLink3URL: C:\ALTIUM_WORK\00001_MCHP-CDB\Library\LibraryRefs\Resistor.SchLib; ComponentLink3Description: Open Symbol; ComponentLink4URL: C:\ALTIUM_WORK\00001_MCHP-CDB\Library\Footprints\RES_C_0402.PcbLib; ComponentLink4Description: Open Footprint; ComponentLink5Description: Open Footprint 2; ComponentLink6Description: Open Footprint 3; ComponentLink7Description: Open Footprint 4; Operating Temperature: -55C to +155C; Category: Resistor; Type: RES SMD; Composition: TKF; Manufacturer 2: Stackpole Electronics Inc.; Manufacturer Part Number 2: RMCF0402FT62K0; Supplier 1: Farnell; Supplier Part Number 1: 2140916; Supplier 2: Digi-Key; Supplier Part Number 2: RMCF0402FT62K0CT-ND; Quantity Override: 1
R19 R27 = RES2130: Manufacturer 1: Panasonic - ECG; Manufacturer Part Number 1: ERJ-2RKF3301X; Description_: RES TKF 3.3k 1% 1/10W SMD 0402; Dev Tools Status: Production; Voltage: 50V; Temperature Coefficient: 100ppm/C; Power: 1/10W; Owner: Mike Ragsdale; Populated: YES; MCHP-ID: RES2130; Revision: 1; Symbol: Resistor; Status: MCL Design; ComponentLink1URL: https://chn-vm-apps.microchip.com/mchprepo/parts/Datasheets/AOA0000C304.pdf; ComponentLink1Description: SVN Datasheet; ComponentLink2URL: C:\ALTIUM_WORK\00001_MCHP-CDB\Datasheets\AOA0000C304.pdf; ComponentLink2Description: Local Datasheet; ComponentLink3URL: C:\ALTIUM_WORK\00001_MCHP-CDB\Library\LibraryRefs\Resistor.SchLib; ComponentLink3Description: Open Symbol; ComponentLink4URL: C:\ALTIUM_WORK\00001_MCHP-CDB\Library\Footprints\RES_C_0402.PcbLib; ComponentLink4Description: Open Footprint; ComponentLink5Description: Open Footprint 2; ComponentLink6Description: Open Footprint 3; ComponentLink7Description: Open Footprint 4; Operating Temperature: -55C to +155C; Category: Resistor; Type: RES SMD; Composition: TKF; Supplier 1: Digi-Key; Supplier Part Number 1: P3.30KLTR-ND; Quantity Override: 1
R30 = RSMT1021: Manufacturer 1: Stackpole Electronics Inc; Manufacturer Part Number 1: RMCF0603FT10R0; Description_: RES TKF 10R 1% 1/10W SMD 0603; Dev Tools Status: Production; Voltage: 50V; Temperature Coefficient: 100ppm/C; Current: 1A; Power: 1/10W; Owner: Aaron VanDuerm; Populated: Yes; MCHP-ID: RSMT1021; Revision: 1; Symbol: Resistor; Status: MCL Design; ComponentLink1URL: https://chn-vm-apps.microchip.com/mchprepo/parts/Datasheets/SEI-RMCF_RMCP.pdf; ComponentLink1Description: SVN Datasheet; ComponentLink2URL: C:\ALTIUM_WORK\00001_MCHP-CDB\Datasheets\SEI-RMCF_RMCP.pdf; ComponentLink2Description: Local Datasheet; ComponentLink3URL: C:\ALTIUM_WORK\00001_MCHP-CDB\Library\LibraryRefs\Resistor.SchLib; ComponentLink3Description: Open Symbol; ComponentLink4URL: C:\ALTIUM_WORK\00001_MCHP-CDB\Library\Footprints\RES_C_0603.PcbLib; ComponentLink4Description: Open Footprint; ComponentLink5Description: Open Footprint 2; ComponentLink6Description: Open Footprint 3; ComponentLink7Description: Open Footprint 4; Operating Temperature: -55C to +155C; Category: Resistor; Type: RES SMD; Composition: TKF; Supplier 1: Digi-Key; Supplier Part Number 1: RMCF0603FT10R0CT-ND; Quantity Override: 1
RB = RES2206: Manufacturer 1: Panasonic Electronic Components; Manufacturer Part Number 1: ERJ-2RKF1301X; Tolerance: 1%; Description_: RES TKF 1.3k 1% 1/10W SMD 0402; Dev Tools Status: Design; Voltage: 50V; Power: 1/10W; Owner: Iulian Margarit; Populated: YES; MCHP-ID: RES2206; Revision: 1; Symbol: Resistor; Status: MCL Design; ComponentLink1URL: https://chn-vm-apps.microchip.com/mchprepo/parts/Datasheets/AOA0000C304.pdf; ComponentLink1Description: SVN Datasheet; ComponentLink2URL: C:\ALTIUM_WORK\00001_MCHP-CDB\Datasheets\AOA0000C304.pdf; ComponentLink2Description: Local Datasheet; ComponentLink3URL: C:\ALTIUM_WORK\00001_MCHP-CDB\Library\LibraryRefs\Resistor.SchLib; ComponentLink3Description: Open Symbol; ComponentLink4URL: C:\ALTIUM_WORK\00001_MCHP-CDB\Library\Footprints\RES_C_0402.PcbLib; ComponentLink4Description: Open Footprint; ComponentLink5Description: Open Footprint 2; ComponentLink6Description: Open Footprint 3; ComponentLink7Description: Open Footprint 4; Operating Temperature: -55C to +155C; Category: Resistor; Type: RES SMD; Composition: TKF; Supplier 1: Digi-Key; Supplier Part Number 1: P1.30KLCT-ND; Quantity Override: 1
RT = RES1023: Manufacturer 1: Panasonic; Manufacturer Part Number 1: ERJ-2RKF2201X; Tolerance: 1%; Description_: RES TKF 2.2k 1% 1/10W SMD 0402; Dev Tools Status: Production; Voltage: 50V; Temperature Coeffcient: 100ppm/C; Power: 1/10W; Owner: Tad Ahlvers; Populated: YES; MCHP-ID: RES1023; Revision: 1; Symbol: Resistor; Status: MCL Design; ComponentLink1URL: https://chn-vm-apps.microchip.com/mchprepo/parts/Datasheets/AOA0000CE2.pdf; ComponentLink1Description: SVN Datasheet; ComponentLink2URL: C:\ALTIUM_WORK\00001_MCHP-CDB\Datasheets\AOA0000CE2.pdf; ComponentLink2Description: Local Datasheet; ComponentLink3URL: C:\ALTIUM_WORK\00001_MCHP-CDB\Library\LibraryRefs\Resistor.SchLib; ComponentLink3Description: Open Symbol; ComponentLink4URL: C:\ALTIUM_WORK\00001_MCHP-CDB\Library\Footprints\RES_C_0402.PcbLib; ComponentLink4Description: Open Footprint; ComponentLink5Description: Open Footprint 2; ComponentLink6Description: Open Footprint 3; ComponentLink7Description: Open Footprint 4; Operating Temperature: -55C to +155C; Category: Resistor; Type: RES SMD; Composition: TKF; Supplier 1: Digi-Key; Supplier Part Number 1: P2.20KLTR-ND; Quantity Override: 1
U3 = MIC6247: Manufacturer 1: Microchip Technology Inc; Manufacturer Part Number 1: MCP1663T-E/OT; Description_: MCHP ANALOG SWITCHER Boost 32V MCP1663T-E/OT SOT-23-5; Dev Tools Status: Production; Owner: Bogdan Popescu; Populated: YES; MCHP-ID: MIC6247; Symbol: MCP1663 SOT-23-5; Type: Switcher; Status: MCL Design; Revision: 1; Category: MCHP-Analog; ComponentLink1URL: https://www.microchip.com/sitesearch/search/Product%20and%20Development%20Tools/MCP1663T-E/OT; ComponentLink1Description: SVN Datasheet; ComponentLink2Description: Local Datasheet; ComponentLink3URL: C:\ALTIUM_WORK\00001_MCHP-CDB\Library\LibraryRefs\MCP1663 SOT-23-5.SchLib; ComponentLink3Description: Open Symbol; ComponentLink4URL: C:\ALTIUM_WORK\00001_MCHP-CDB\Library\Footprints\SOT-23-5.PcbLib; ComponentLink4Description: Open Footprint; ComponentLink5Description: Open Footprint 2; ComponentLink6Description: Open Footprint 3; ComponentLink7Description: Open Footprint 4; Supplier 1: Microchip Technology Inc; Supplier Part Number 1: MCP1663T-E/OT; Operating Temperature: -40C to +125C; Quantity Override: 1
U4 = CH340G: USB Interface Integrated Circuit; MF: WCH; Price: None; SnapEDA_Link: https://www.snapeda.com/parts/Ch340G/WCH/view-part/?ref=snap; MP: Ch340G; Value: *; Availability: Not in stock; Package: None; Check_prices: https://www.snapeda.com/parts/Ch340G/WCH/view-part/?ref=eda
U9 U? = MIC6213: LDO; Manufacturer 1: Microchip; Manufacturer Part Number 1: MCP1703AT-3302E/CB; Description_: MCHP ANALOG LDO 3.3V MCP1703AT-5002E/CB SOT-23A-3; MAPS Description: LOWIQ 250MA LDO, VIN 16V MAX, VOUT=3.3V; Dev Tools Status: Production; Owner: Tad Ahlvers; MPC: HBAF1YM7XA33; LeadContent: Pb-FREE; PackingMedia: T/R; Stage: REL; LeadCount: 3; ForceMinOrderQtyMult: True; MinOrderQty: 1; TempRange: -40C to +125C; tblDeviceFamilyID: 3495; Populated: YES; MCHP-ID: MIC6213; Symbol: MCP170X SOT-23-3_SOT-23A-3; Type: LDO; Status: MCL Design; Revision: 1; Category: MCHP-Analog; ComponentLink1URL: http://www.microchip.com/wwwproducts/MCP1703A; ComponentLink1Description: SVN Datasheet; ComponentLink2Description: Local Datasheet; ComponentLink3URL: C:\ALTIUM_WORK\00001_MCHP-CDB\Library\LibraryRefs\MCP170X SOT-23-3_SOT-23A-3.SchLib; ComponentLink3Description: Open Symbol; ComponentLink4URL: C:\ALTIUM_WORK\00001_MCHP-CDB\Library\Footprints\SOT-23A-3.PcbLib; ComponentLink4Description: Open Footprint; ComponentLink5Description: Open Footprint 2; ComponentLink6Description: Open Footprint 3; ComponentLink7Description: Open Footprint 4; Supplier 1: Digi-Key; Supplier Part Number 1: MCP1703AT-3302E/CBCT-ND; IntroductionDate: 2012-03-15; PackageType: SOT-23A; Quantity Override: 1
Y1 = ABM8-12.000MHZ-B2-T3: 12MHz Â±20ppm Crystal 18pF 120 Ohms 4-SMD, No Lead; MF: Abracon; Package: SMD-4 Abracon; Price: None; MP: ABM8-12.000MHZ-B2-T3; Availability: Bad; Value: *; SnapEDA_Link: https://www.snapeda.com/parts/ABM8-12.000MHZ-B2-T3/Abracon%20LLC/view-part/1219277/?ref=snap; Check_prices: https://www.snapeda.com/parts/ABM8-12.000MHZ-B2-T3/Abracon%20LLC/view-part/1219277/?ref=eda